# EAGLE design ece411-t10-Receiver (EAGLE 7.2.0)
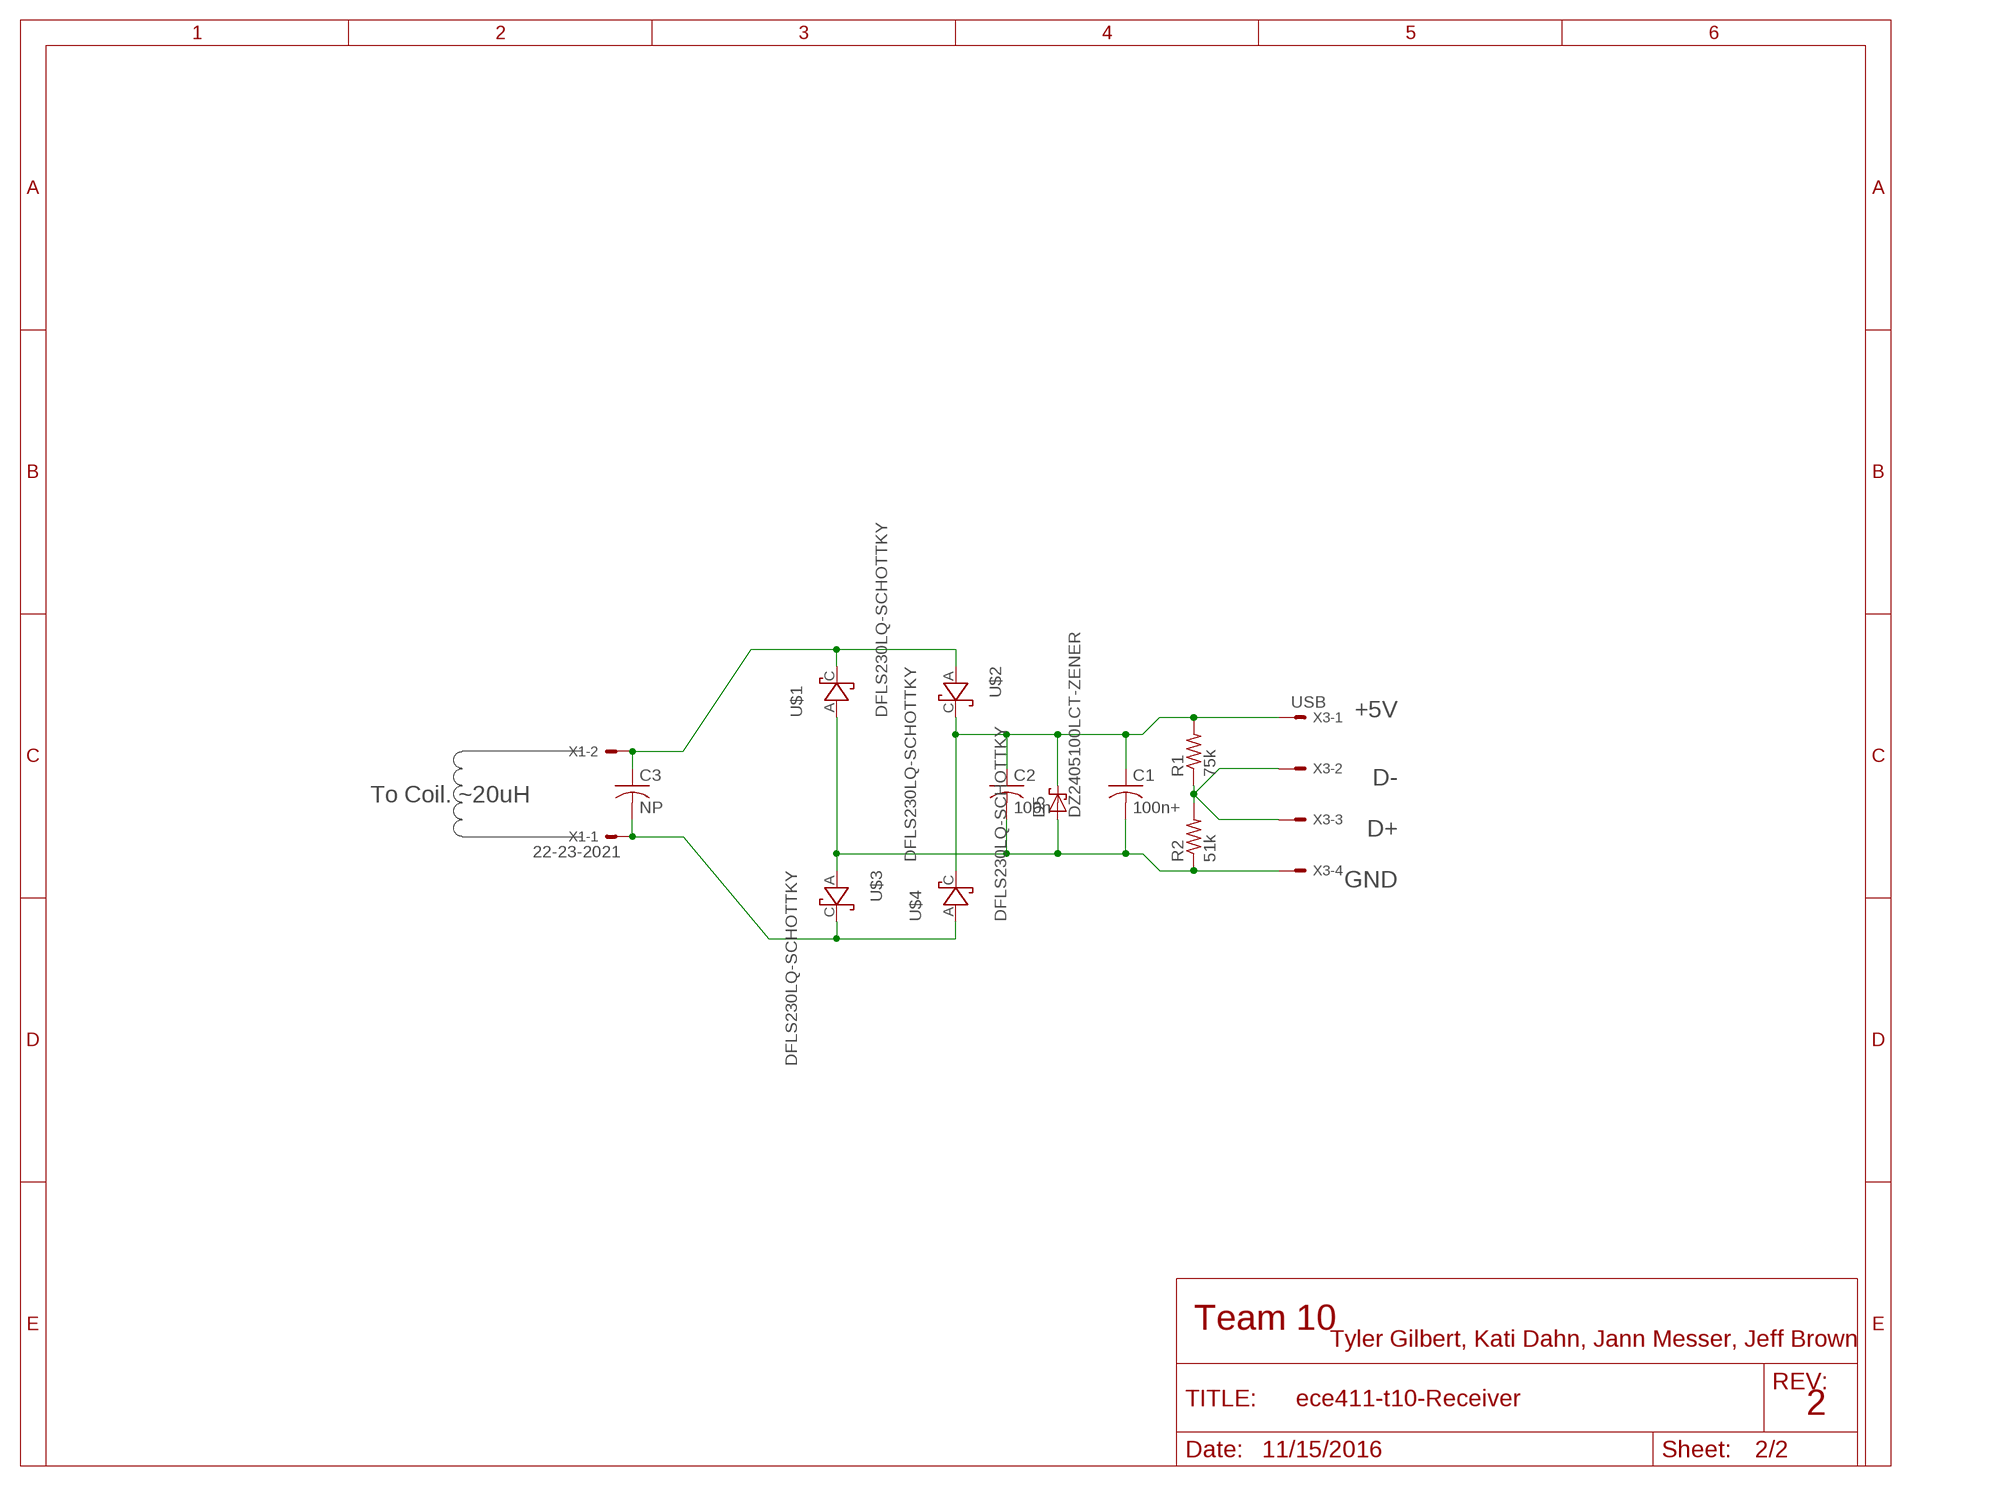
[diagram p0: schematic, sheet 1]

## Parts
C1  100n+  C-USC0805  [C0805]
C2  100n  C-USC0805  [C0805]
C3  NP  C-USC0805  [C0805]
D5  DZ2405100LCT-ZENER  [ZENER_PWR_PKG]
R1  75k  R-US_R0805  [R0805]
R2  51k  R-US_R0805  [R0805]
U$1  DFLS230LQ-SCHOTTKY  [PWRDI123]
U$2  DFLS230LQ-SCHOTTKY  [PWRDI123]
U$3  DFLS230LQ-SCHOTTKY  [PWRDI123]
U$4  DFLS230LQ-SCHOTTKY  [PWRDI123]
X1  22-23-2021  [22-23-2021]
X3  USB  22-23-2041  [22-23-2041]

## Nets
5V: C1.1 C2.1 D5.C R1.2 U$2.C U$4.C X3.1
GND: C1.2 C2.2 D5.A R2.1 U$1.A U$3.A X3.4
N$1: C3.1 U$1.C U$2.A X1.2
N$2: C3.2 U$3.C U$4.A X1.1
N$5: R1.1 R2.2 X3.2 X3.3

## Notes on the sheet
- +5V
- D-
- To Coil. ~20uH
- D+
- GND

## Library data of the parts
C1-C3 = adafruit:C-US: CAPACITOR, American symbol
D5 = _VMS:DZ2405100LCT-ZENER: Zener Diode 5.1V
R1 R2 = resistor:R-US_: RESISTOR, American symbol
U$1-U$4 = _VMS:DFLS230LQ-SCHOTTKY
X1 = con-molex:22-23-2021: .100" (2.54mm) Center Header - 2 Pin; MF: MOLEX; MPN: 22-23-2021; OC_FARNELL: 1462926; OC_NEWARK: 25C3832
X3 = con-molex:22-23-2041: .100" (2.54mm) Center Header - 4 Pin; MF: MOLEX; MPN: 22-23-2041; OC_FARNELL: 1462920; OC_NEWARK: 38C0355

## Board
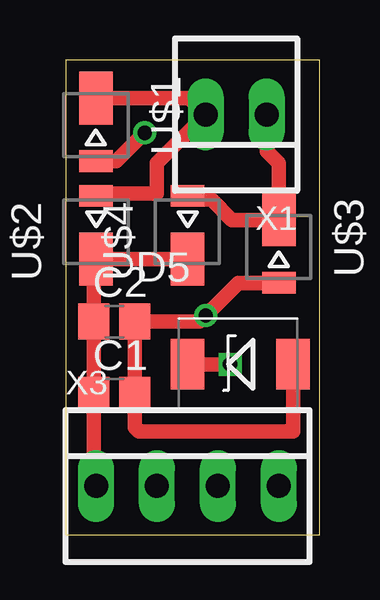
[diagram p1: board, top side]
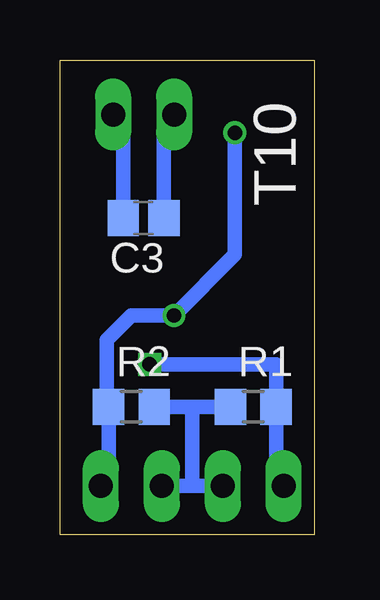
[diagram p2: board, bottom side, seen from below]

Size 10.59 x 19.8 mm. Coordinates in mm from the lower left corner, seen from the top.
Outline: 0,0 10.59,0 10.59,19.8 0,19.8 0,0
Copper layers (1*16): Top 0.0356mm / dielectric 1.5011mm / Bottom 0.0356mm
Design rules "oshpark-2layer": minimum track width 6mil, minimum drill 13mil, track to track 6mil, track to pad 6mil, pad to pad 6mil, via to via 6mil, smd to smd 6mil, copper to edge 15mil, drill to drill 6mil, minimum pad ring 7mil, minimum via ring 7mil, stop-mask expansion 2.5mil, vias tented up to drill 0mil, thermal gap 10mil

### Footprints (pad centres in the part's own frame; a part is rotated, then mirrored left to right if it is on the bottom)
C0805 = smd 1.3 x 1.5: 1 -0.85,0; 2 0.85,0
ZENER_PWR_PKG = smd 1.4 x 2.1: A 4.4,0; C 0,0
R0805 = smd 1.3 x 1.5: 1 -0.95,0; 2 0.95,0
PWRDI123 = smd 0.9 x 1.4: A 1.18,0 | smd 2.2 x 1.4: C -1.45,0
22-23-2021 = drill 1 long: 1 -1.27,0; 2 1.27,0
22-23-2041 = drill 1 long: 1 -3.81,0; 2 -1.27,0; 3 1.27,0; 4 3.81,0

### Placement (x,y rotation side)
C1  2.03,5.84 0 top
C2  2.03,8.89 0 top
C3  7.11,13.21 180 bottom
D5  5.08,7.11 0 top
R1  2.54,5.33 0 bottom
R2  7.62,5.33 0 bottom
U$1  1.27,16.76 270 top
U$2  1.27,12.95 90 top
U$3  8.89,11.68 270 top
U$4  5.08,12.95 90 top
X1  7.11,17.53 180 top
X3  5.08,2.03 0 top

### Tracks (layer width: path | path; a pad name or v marks a point on that pad's centre or on a via)
5V  (via drill 0.6)
  Top 0.61: X3.1 1.18,2.03 C1.1 C2.1 1.18,11.5 U$2.C U$4.C | D5.C v6.86,7.11
  Bottom 0.61: X3.1 1.59,2.35 R1.2 1.59,7.11 v6.86,7.11
GND  (via drill 0.6)
  Top 0.61: D5.A 9.48,4.32 3.05,4.32 2.88,4.48 C1.2 C2.2 5.59,8.89 v5.84,9.14 7.2,10.5 U$3.A | U$1.A 2.12,15.58 v3.3,16.76
  Bottom 0.61: X3.4 8.57,2.35 R2.1 8.64,5.4 8.64,8.13 7.62,9.14 v5.84,9.14 3.3,11.68 v3.3,16.76
N$1
  Top 0.61: U$2.A 1.27,14.22 3.81,14.22 3.81,15.49 X1.2 5.15,18.21 U$1.C
  Bottom 0.61: C3.1 6.26,17.11 X1.2
N$2
  Top 0.61: U$4.A 5.24,13.97 6.1,13.97 6.93,13.13 U$3.C 8.89,15.49 8.38,16 X1.1
  Bottom 0.61: C3.2 7.96,17.11 X1.1
N$5
  Bottom 0.61: 5.08,5.33 R2.2 | X3.2 5.08,2.03 | 5.08,2.03 X3.3 | R1.1 5.08,5.33 | 5.08,5.33 5.08,2.03

### Text on the board
bNames: T10